# EAGLE schematic piezo-preamp-tickler_V3-4_single-supply-OPA164 (EAGLE 8.5.0)

## Sheet 1 of 2
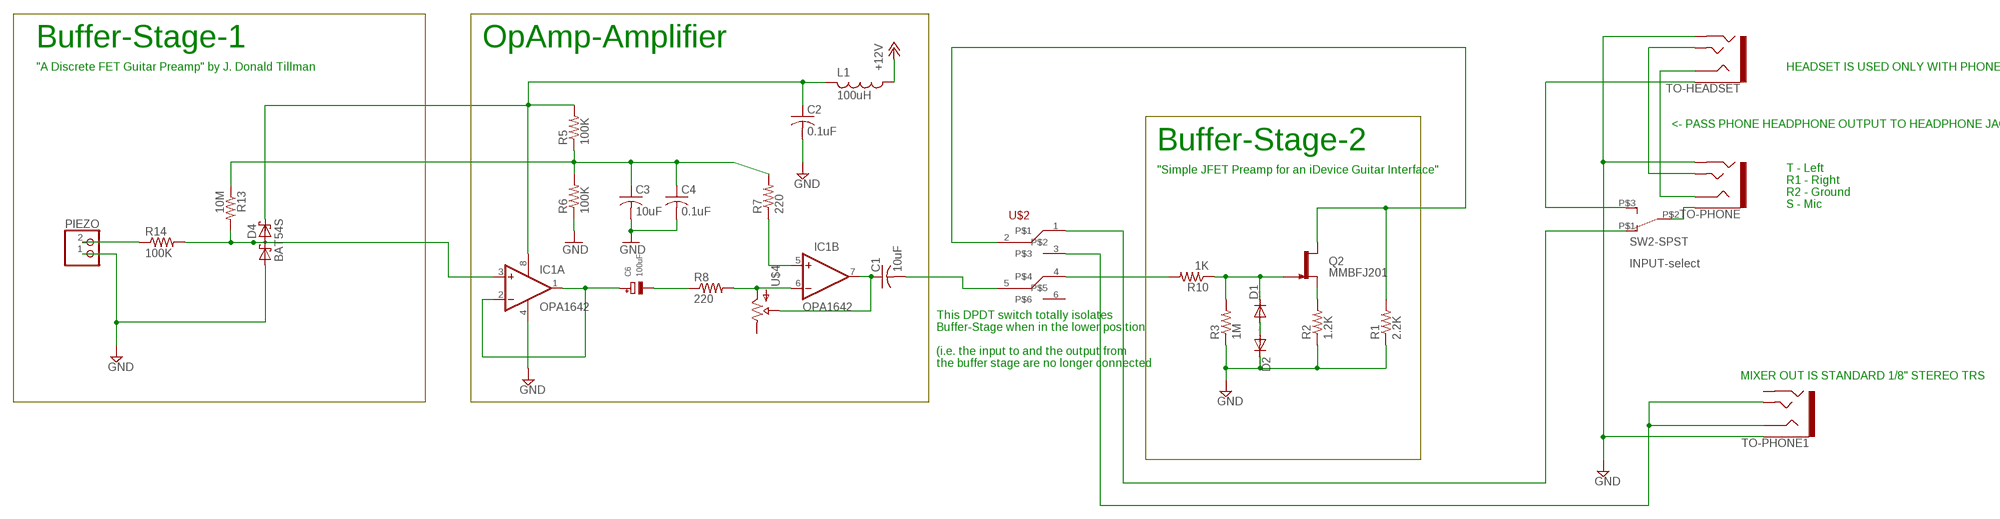
[diagram p0: schematic, sheet 1]

### Parts
C1  10uF  C-USC0603  [C0603]
C2  0.1uF  C-USC0805K  [C0805K]
C3  10uF  C-USC0805K  [C0805K]
C4  0.1uF  C-USC0805K  [C0805K]
C6  100uF  CAP_TANTALUMA/3216_REFLOW  [EIA3216-18/A-R]
D1  DIODE-SOD123  [SOD123]
D2  DIODE-SOD123  [SOD123]
D4  BAT54S  [SOT23]
IC1  OPA1642  OPA2134UA  [SO08]
L1  100uH  L-USL3225P  [L3225P]
PIEZO  JST_2PIN-THM  [JST-PH-2-THM]
Q2  MMBFJ201  J201SOT-23  [SOT23-3]
R1  2.2K  R-US_R0603  [R0603]
R2  1.2K  R-US_R0603  [R0603]
R3  1M  R-US_R0603  [R0603]
R5  100K  R-US_R0603  [R0603]
R6  100K  R-US_R0603  [R0603]
R7  220  R-US_R0603  [R0603]
R8  220  R-US_R0603  [R0603]
R10  1K  R-US_R0603  [R0603]
R13  10M  R-US_R0603  [R0603]
R14  100K  R-US_R0603  [R0603]
SW2-SPST  INPUT-select  SWITCH_SPDTCL-SB-12B  [SWITCH_SPDT_CL-SB-12B]
TO-HEADSET  AUDIO-JACK3LGPADS  [AUDIO-JACK-TRRS-SMD]
TO-PHONE  AUDIO-JACK3LGPADS  [AUDIO-JACK-TRRS-SMD]
TO-PHONE1  AUDIO-JACK3LGPADS  [AUDIO-JACK-TRRS-SMD]
U$2  SWITCH_DPDT  [SWITCH_DPDT_CL-SB-22B]
U$4  POTPOT-THUMB-ALPHA  [POT-THUMB-14MM_ALPHA-RV100F-30-4K1B-B10K-B301]

### Nets
+12V: L1.1 ; also sheet 2
GND: C2.2 C3.2 C4.2 D2.C D4.1(A1) IC1.4(A:V-) PIEZO.1 R1.1 R2.1 R3.1 R6.1 TO-HEADSET.RING2 TO-PHONE1.EARTH TO-PHONE.RING2 ; also sheet 2
N$1: D1.A D2.A
N$2: PIEZO.2 R14.1
N$3: Q2.2(S) R2.2
N$4: TO-HEADSET.EARTH
N$5: IC1.5(B:+IN) R7.1
N$6: C1.1 IC1.7(B:OUT) U$4.P$3(WIPER)
N$7: IC1.6(B:-IN) R8.2 U$4.P$1(IN)
N$9: D4.3(C1A2) IC1.3(A:+IN) R13.2 R14.2
N$10: D1.C Q2.3(G) R3.2 R10.1
N$11: R10.2 U$2.4
N$12: TO-PHONE1.RING1 TO-PHONE1.TIP U$2.3
N$13: TO-HEADSET.TIP TO-PHONE.TIP
N$14: C6.- R8.1
N$15: TO-HEADSET.RING1 TO-PHONE.RING1
N$16: C1.2 U$2.5
N$17: SW2-SPST.P$2 TO-PHONE.EARTH
N$19: SW2-SPST.P$1 U$2.1
N$23: C3.1 C4.1 R5.1 R6.2 R7.2 R13.1
N$24: C6.+ IC1.1(A:OUT) IC1.2(A:-IN)
N$25: C2.1 D4.2(C2) IC1.8(A:V+) L1.2 R5.2
SELECT: Q2.1(D) R1.2 U$2.2
Unconnected: SW2-SPST.P$3 TO-PHONE1.RING2 U$2.6 U$4.P$2(OUT)

### Notes on the sheet
- Buffer-Stage-1 | OpAmp-Amplifier
- "A Discrete FET Guitar Preamp" by J. Donald Tillman | HEADSET IS USED ONLY WITH PHONE
- <- PASS PHONE HEADPHONE OUTPUT TO HEADPHONE JACK
- Buffer-Stage-2
- "Simple JFET Preamp for an iDevice Guitar Interface"
- T - Left
  R1 - Right
  R2 - Ground
  S - Mic
- This DPDT switch totally isolates 
  Buffer-Stage when in the lower position
  
  (i.e. the input to and the output from 
  the buffer stage are no longer connected
- MIXER OUT IS STANDARD 1/8" STEREO TRS

## Sheet 2 of 2
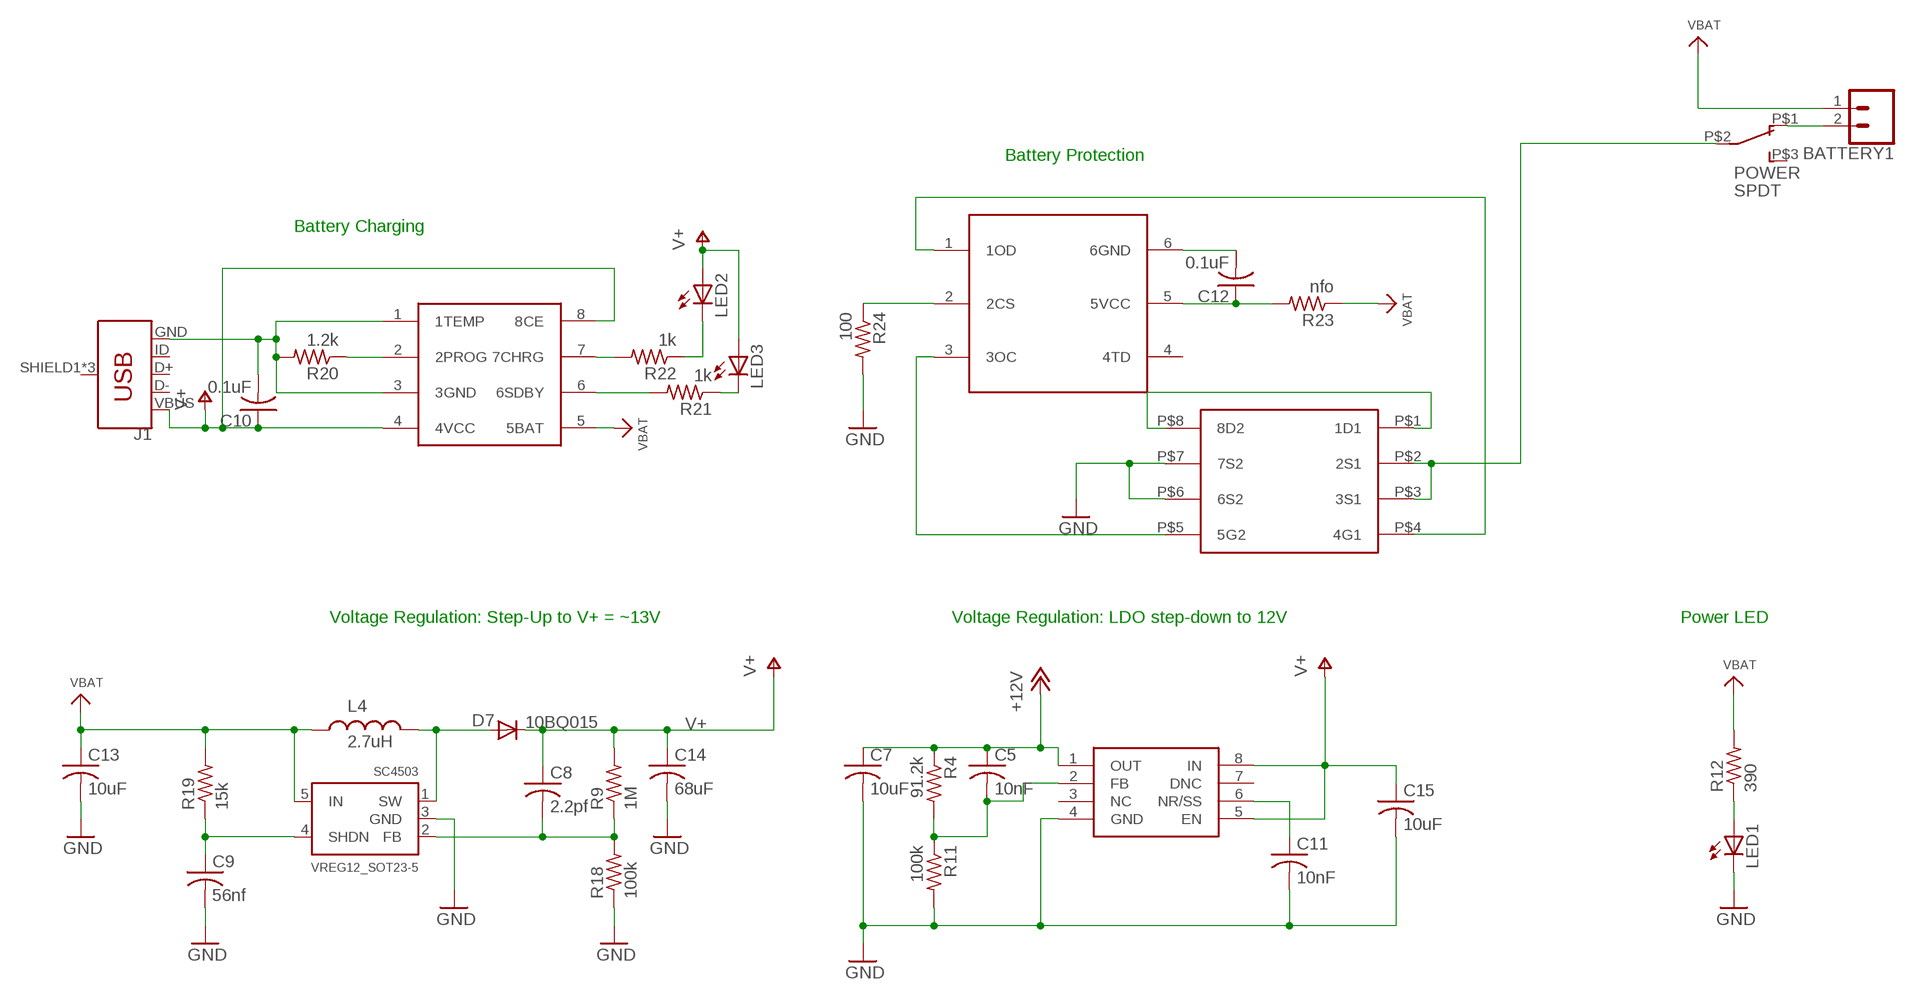
[diagram p1: schematic, sheet 2]

### Parts
BATTERY1  CONN_02LOCK  [1X02_LOCK]
C5  10nF  C-USC0603  [C0603]
C7  10uF  C-USC0603  [C0603]
C8  2.2pf  C-USC0805  [C0805]
C9  56nf  C-USC0805  [C0805]
C10  0.1uF  C-USC0805K  [C0805K]
C11  10nF  C-USC0603  [C0603]
C12  0.1uF  C-USC0805K  [C0805K]
C13  10uF  C-USC0805  [C0805]
C14  68uF  C-USC0805  [C0805]
C15  10uF  C-USC0603  [C0603]
D7  10BQ015  DIODESMA  [SMA-DIODE]
DW01A  DW01A  [SOT23-6]
F8205A  F8205A  [F8205A]
J1  USB_MICRO-BREDUCED_PASTE  [USB-B-MICRO-SMD_RED_PASTE]
L4  2.7uH  INDUCTORCR54  [CR54]
LED1  LED3MM  [LED3MM]
LED2  LED3MM  [LED3MM]
LED3  LED3MM  [LED3MM]
POWER  SPDT  SWITCH_SPDTCL-SB-12B  [SWITCH_SPDT_CL-SB-12B]
R4  91.2k  R-US_R0603  [R0603]
R9  1M  R-US_R0603  [R0603]
R11  100k  R-US_R0603  [R0603]
R12  390  R-US_R0805  [R0805]
R18  100k  R-US_R0603  [R0603]
R19  15k  R-US_R0603  [R0603]
R20  1.2k  R-US_R0603  [R0603]
R21  1k  R-US_R0603  [R0603]
R22  1k  R-US_R0603  [R0603]
R23  nfo  R-US_R0603  [R0603]
R24  100  R-US_R0603  [R0603]
SC4503  VREG12_SOT23-5  [SOT23-5]
TP4056  TP4056-CHIP  [SO08]
U$5  TPS7A49  [MSOP-8]

### Nets
+12V: C5.1 C7.1 R4.1 U$5.1(OUT) ; also sheet 1
GND: C7.2 C9.2 C11.2 C13.2 C14.2 C15.2 F8205A.P$6(6S2) F8205A.P$7(7S2) LED1.K(C) R11.2 R18.1 R24.2 SC4503.3(GND) U$5.4(GND) ; also sheet 1
N$18: LED1.A R12.1
N$20: F8205A.P$2(2S1) F8205A.P$3(3S1) POWER.P$2
N$21: BATTERY1.2 POWER.P$1
N$26: C5.2 R4.2 R11.1 U$5.2(FB)
N$28: C11.1 U$5.6(NR/SS)
N$29: C9.1 R19.1 SC4503.4(SHDN)
N$30: C8.2 R9.1 R18.2 SC4503.2(FB)
N$32: D7.A L4.P$2 SC4503.1(SW)
N$33: C10.2 J1.GND R20.2 TP4056.1(1TEMP) TP4056.3(3GND)
N$34: DW01A.1(1OD) F8205A.P$4(4G1)
N$35: R20.1 TP4056.2(2PROG)
N$36: DW01A.3(3OC) F8205A.P$5(5G2)
N$37: R22.2 TP4056.7(7CHRG)
N$38: R21.2 TP4056.6(6SDBY)
N$39: LED3.K(C) R21.1
N$40: LED2.K(C) R22.1
N$41: C12.1 DW01A.5(5VCC) R23.2
N$42: C12.2 DW01A.6(6GND)
N$43: DW01A.2(2CS) R24.1
N$44: F8205A.P$1(1D1) F8205A.P$8(8D2)
V+: C8.1 C10.1 C14.1 C15.1 D7.C J1.VBUS LED2.A LED3.A R9.2 TP4056.4(4VCC) TP4056.8(8CE) U$5.5(EN) U$5.8(IN)
VBAT: BATTERY1.1 C13.1 L4.P$1 R12.2 R19.2 R23.1 SC4503.5(IN) TP4056.5(5BAT)
Unconnected: DW01A.4(4TD) J1.D+ J1.D- J1.ID J1.SHIELD1(SHIELD) J1.SHIELD2(SHIELD) J1.SHIELD3(SHIELD) POWER.P$3 U$5.3(NC) U$5.7(DNC)

### Notes on the sheet
- Battery Protection
- Battery Charging
- Voltage Regulation: Step-Up to V+ = ~13V | Voltage Regulation: LDO step-down to 12V | Power LED

## Library data of the parts
BATTERY1 = SparkFun-Connectors:CONN_02: Multi connection point. Often used as Generic Header-pin footprint for 0.1 inch spaced/style header connections On any of the 0.1 inch spaced packages, you can populate with these: Break Away Headers - Straight <https://www.sparkfun.com/products/116> (PRT-00116) Break Away Male Headers - Right Angle <https://www.sparkfun.com/products/553> (PRT-00553) Female Headers <https://www.sparkfun.com/products/115> (PRT-00115) Break Away Headers - Machine Pin <https://www.sparkfun.com/products/117> (PRT-00117) Break Away Female Headers - Swiss Machine Pin <https://www.sparkfun.com/products/743> (PRT-00743) For SCREWTERMINALS and SPRING TERMINALS visit here: Screw Terimnals on SparkFun.com <https://www.sparkfun.com/search/results?term=Screw+Terminals> (5mm/3.5mm/2.54mm spacing) This device is also useful as a general connection point to wire up your design to another part of your project. Our various solder wires solder well into these plated through hole pads. Hook-Up Wire - Assortment (Stranded, 22 AWG) <https://www.sparkfun.com/products/11375> (PRT-11375) Hook-Up Wire - Assortment (Solid Core, 22 AWG) <https://www.sparkfun.com/products/11367> (PRT-11367) View the entire wire category on our website here <https://www.sparkfun.com/categories/141> Special notes: Molex polarized connector foot print use with: PRT-08233 with associated crimp pins and housings. 2.54_SCREWTERM for use with PRT-10571. 3.5mm Screw Terminal footprints for PRT-08084 5mm Screw Terminal footprints for use with PRT-08432
C1-C5 C7-C15 = adafruit:C-US: CAPACITOR, American symbol
C6 = microbuilder:CAP_TANTALUM: Tantalum Capacitors Wave footprints have larger pads and are meant to be used for hand soldering. Reflow footprints are optimised for solder paste and a reflow oven. EIA3216-18/A-[R/W] - Size A / 3216-18 / 1206 footprint 4.7µF 25V 10% Tantalum Capacitor 10µF 16V 10% Tantalum Capacitor [Digikey: 495-2236-2-ND] EIA3528-21/B-[R/W] - Size B / 3528-21 47µF 10V 10% Tantalum Capactior [Digikey: 495-2216-1-ND] EIA6032-28/C-[R/W] - Size C / 6032-28 10µF 35V 20% Tantalum Capacitor [Digikey: 495-2285-1-ND] 100µF 16V 10% Tantalum Capactior [Digikey: 399-5214-1-ND]
D1 D2 = diode:DIODE-: DIODE
D4 = diode:BAT54S: Schottky Diodes Pin connection corrected 2011-05-04 Source: Fairchild .. BAT54.pdf
D7 = SparkFun:DIODE: Diode These are standard reverse protection diodes and small signal diodes. SMA package can handle up to about 1A. SOD-323 can handle about 200mA. What the SOD-323 package when ordering, there are some mfgs out there that are 5-pin packages.
DW01A = CMU-ArtFab:DW01A
F8205A = CMU-ArtFab:F8205A
IC1 = linear:OPA2*: Dual Operational Amplifier Low Power, Single-Supply, Rail-To-Rail Operational Amplifier Source: http://focus.ti.com/lit/ds/symlink/opa2345.pdf http://focus.ti.com .. opa241.pdf http://focus.ti.com/lit/ds/symlink/opa2134.pdf
J1 = SparkFun-Connectors:USB_MICRO-B: USB Type Micro-B Connector Male/female and PTH/SMT variants SparkFun Products: SparkFun microB USB Breakout <https://www.sparkfun.com/products/12035> SparkFun USB microB Plug Breakout <https://www.sparkfun.com/products/10031> SparkFun ESP8266 Thing <https://www.sparkfun.com/products/13231>; PROD_ID: CONN-11752
L1 = rcl:L-US: INDUCTOR, American symbol; SPICEPREFIX: L
L4 = SparkFun:INDUCTOR: Inductors Basic Inductor/Choke - 0603 and 1206. Footprints are not proven and vary greatly between part numbers.
LED1-LED3 = led:LED: LED OSRAM: - CHIPLED LG R971, LG N971, LY N971, LG Q971, LY Q971, LO R971, LY R971 LH N974, LH R974 LS Q976, LO Q976, LY Q976 LO Q996 - Hyper CHIPLED LW Q18S LB Q993, LB Q99A, LB R99A - SideLED LS A670, LO A670, LY A670, LG A670, LP A670 LB A673, LV A673, LT A673, LW A673 LH A674 LY A675 LS A676, LA A676, LO A676, LY A676, LW A676 LS A679, LY A679, LG A679 - Hyper Micro SIDELED® LS Y876, LA Y876, LO Y876, LY Y876 LT Y87S - SmartLED LW L88C, LW L88S LB L89C, LB L89S, LG L890 LS L89K, LO L89K, LY L89K LS L896, LA L896, LO L896, LY L896 - TOPLED LS T670, LO T670, LY T670, LG T670, LP T670 LSG T670, LSP T670, LSY T670, LOP T670, LYG T670 LG T671, LOG T671, LSG T671 LB T673, LV T673, LT T673, LW T673 LH T674 LS T676, LA T676, LO T676, LY T676, LB T676, LH T676, LSB T676, LW T676 LB T67C, LV T67C, LT T67C, LS T67K, LO T67K, LY T67K, LW E67C LS E67B, LA E67B, LO E67B, LY E67B, LB E67C, LV E67C, LT E67C LW T67C LS T679, LY T679, LG T679 LS T770, LO T770, LY T770, LG T770, LP T770 LB T773, LV T773, LT T773, LW T773 LH T774 LS E675, LA E675, LY E675, LS T675 LS T776, LA T776, LO T776, LY T776, LB T776 LHGB T686 LT T68C, LB T68C - Hyper Mini TOPLED® LB M676 - Mini TOPLED Santana® LG M470 LS M47K, LO M47K, LY M47K Source: http://www.osram.convergy.de LUXEON: - LUMILED® LXK2-PW12-R00, LXK2-PW12-S00, LXK2-PW14-U00, LXK2-PW14-V00 LXK2-PM12-R00, LXK2-PM12-S00, LXK2-PM14-U00 LXK2-PE12-Q00, LXK2-PE12-R00, LXK2-PE12-S00, LXK2-PE14-T00, LXK2-PE14-U00 LXK2-PB12-K00, LXK2-PB12-L00, LXK2-PB12-M00, LXK2-PB14-N00, LXK2-PB14-P00, LXK2-PB14-Q00 LXK2-PR12-L00, LXK2-PR12-M00, LXK2-PR14-Q00, LXK2-PR14-R00 LXK2-PD12-Q00, LXK2-PD12-R00, LXK2-PD12-S00 LXK2-PH12-R00, LXK2-PH12-S00 LXK2-PL12-P00, LXK2-PL12-Q00, LXK2-PL12-R00 Source: www.luxeon.com KINGBRIGHT: KA-3528ASYC Source: www.kingbright.com
PIEZO = adafruit:JST_2PIN: JST 2-Pin Connectors of various flavors SMT-RA (S2B-PH-SM4) 4UConnector #17311 SMT (B2B-PH-SM4) THM-RA (S2B-PH) THM (B2B-PH)
POWER SW2-SPST = CMU-ArtFab:SWITCH_SPDT
Q2 = CMU-ArtFab:J201: N-channel JFET
R1-R14 R18-R24 = CMU-ArtFab:R-US_: RESISTOR, American symbol
SC4503 = CMU-ArtFab:VREG12_SOT23-5: SOT23-5 Fixed Voltage Regulators To better organise some of the SOT23-5 fixed voltage regulators in this library, this new part was created. Part Current Out V Out V In V Dropout Digikey Part No. ADP121 150mA 3.3V 3.4-5.5V 0.09V @ 150mA ADP121-AUJZ33R7CT-ND ADP121 150mA 3.0V 3.1-5.5V 0.09V @ 150mA ADP121-AUJZ30R7CT-ND ADP122 300mA 3.3V 3.4-5.5V 0.085V @ 300mA ADP122AUJZ-3.3-R7CT-ND ADP1712 300mA 3.3V 3.5-5.5V 0.17V @ 300mA ADP1712AUJZ-3.3-R7TR-ND AP7311 (Low Cost) 150mA 3.3V 3.5-6V 0.15V @ 150mA AP7311-33WG-7DICT-ND LD39015M18R 150mA 1.8V 1.9V-5.5V 0.08V @ 100mA 497-6977-1-ND MCP1824T-3302E/OT 300mA 3.3V 3.5V-6V 0.2V @ 300mA MCP1824T-3302E/OTCT-ND MIC5205-2.5YM5 TR 150mA 2.5V 2.7-16V 0.165V @ 150mA 576-1257-2-ND MIC5205-3.0YM5 TR 150mA 3.0V 3.2V-16V 0.165V @ 150mA 576-1258-2-ND MIC5205-3.3YM5 TR 150mA 3.3V 3.5V-16V 0.165V @ 150mA 576-1259-2-ND TPS780330220 150mA 3.3V+2.2V 3.6-5.5V 250mV Max 296-23332-1-ND TDA3663/N1,135 100mA 3.3V 3.5-45V 0.18V @ 50mA 568-5343-1-ND
TO-HEADSET TO-PHONE TO-PHONE1 = Daniel:AUDIO-JACK3: Audio jack - 3.5mm TRRS variety - two rings.
TP4056 = CMU-ArtFab:TP4056-CHIP
U$2 = CMU-ArtFab:SWITCH_DPDT
U$4 = CMU-ArtFab:POT: http://www.taydaelectronics.com/10k-ohm-linear-taper-potentiometer-round-shaft-pcb-9mm.html http://www.taydaelectronics.com/datasheets/A-1847.pdf
U$5 = CMU-ArtFab:TPS7A49